# Altium schematic sheet Red_Driver.SchDoc
size 381 x 241 mm; SheetNumber: 6; SheetTotal: 7
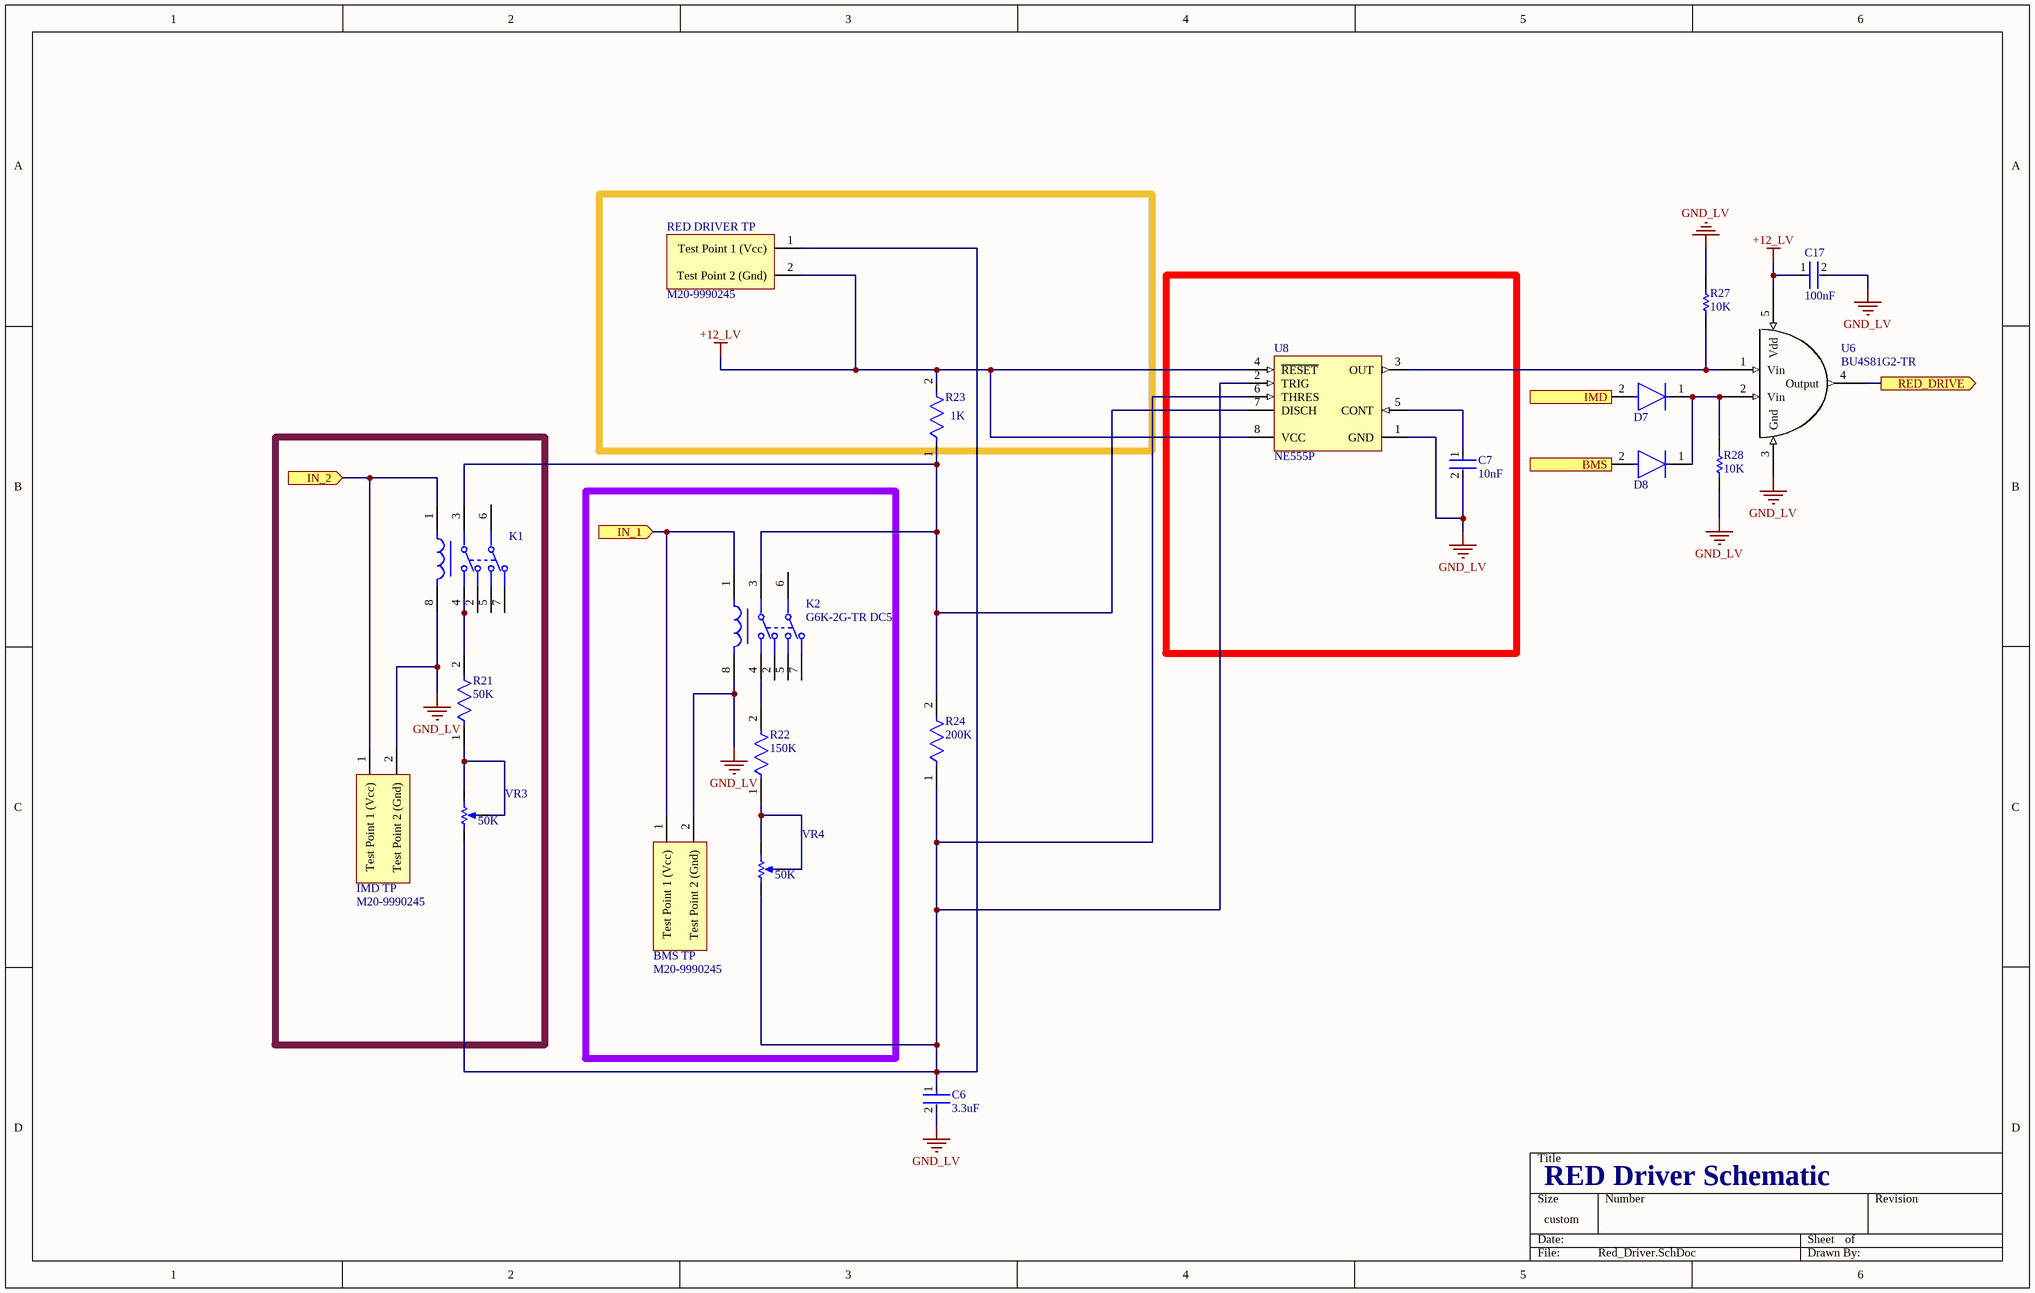
[diagram p0: Red_Driver.SchDoc]

## Parts
BMS_TP  M20-9990245  [12MM_HEADER__M20-9991245]
C6  3.3uF  [FP-RCE2K1-MFG]
C7  10nF  [FP-K155L2-MFG]
C17  100nF  [FP-C1206C-EB-MFG]
D7  DO-204AH_8_CENTRALSEMI_1  [FP-JANTXV1N486B-MFG]  (value not drawn)
D8  DO-204AH_8_CENTRALSEMI_1  [FP-JANTXV1N486B-MFG]  (value not drawn)
IMD_TP  M20-9990245  [12MM_HEADER__M20-9991245]
K1  G6K-2G-TR DC5  [FP-G6K-2G-TR_DC5-MFG]  (value not drawn)
K2  G6K-2G-TR DC5  [FP-G6K-2G-TR_DC5-MFG]
R21  50K  [RS00550K00FE73-Footprint-1]
R22  150K  [MFR-25FTE52-150K-Footprint-1]
R23  1K  [FP-RLR07-MFG]
R24  200K  [CFR-25JB-52-200K-Footprint-1]
R27  10K  [R_1206_YAGEO_AC]
R28  10K  [R_1206_YAGEO_AC]
RED_DRIVER_TP  M20-9990245  [12MM_HEADER__M20-9991245]
U6  BU4S81G2-TR  [SSOP5__ROHM_SEMICONDUCTOR__TSZ02201-0RDR0GZ00200-1-2]
U8  NE555P  [P0008A]
VR3  50K  [3006P-1-503LF-Footprint-1]
VR4  50K  [3006P-1-503LF-Footprint-1]

## Ports
BMS (in), IMD (in), IN_1 (in), IN_2 (in), RED_DRIVE (out)

## Nets
+12_LV: C17.1 R23.2 RED_DRIVER_TP.2(Test_Point_2_(Gnd)) U6.5(Vdd) U8.4(~{RESET}) U8.8(VCC)
GND_LV: BMS_TP.2(Test_Point_2_(Gnd)) C6.2 C7.2 C17.2 IMD_TP.2(Test_Point_2_(Gnd)) K1.8 K2.8 R27.1 R28.2 U6.3(Gnd) U8.1(GND)
BMS: D8.2(A) ; port BMS
IMD: D7.2(A) ; port IMD
IN_1: BMS_TP.1(Test_Point_1_(Vcc)) K2.1 ; port IN_1
IN_2: IMD_TP.1(Test_Point_1_(Vcc)) K1.1 ; port IN_2
RED_DRIVE: U6.4(Output) ; port RED_DRIVE
NetC6_1: C6.1 R24.1 RED_DRIVER_TP.1(Test_Point_1_(Vcc)) U8.2(TRIG) U8.6(THRES) VR3.3(CW) VR4.3(CW)
NetC7_1: C7.1 U8.5(CONT)
NetD7_1: D7.1(C) D8.1(C) R28.1 U6.2(Vin)
NetK1_3: K1.3 K2.3 R23.1 R24.2 U8.7(DISCH)
NetK1_4: K1.4 R21.2
NetK2_4: K2.4 R22.2
NetR21_1: R21.1 VR3.1(CCW) VR3.2(WIPER)
NetR22_1: R22.1 VR4.1(CCW) VR4.2(WIPER)
NetR27_2: R27.2 U6.1(Vin) U8.3(OUT)

Not connected (* = marked no-connect by the designer): K1 2 5 6 7; K2 2 5 6 7

## Notes on the sheet
- RED Driver Schematic

## Library data of the parts
BMS_TP IMD_TP RED_DRIVER_TP = CMP-081-000004-1: CONN HEADER VERT 2POS 2.54MM; Manufacturer: Harwin Inc.; PN: 952-2261-ND; Max Operating Temperature: 105 °C; Min Operating Temperature: -40 °C; ComponentLink1URL: https://www.digikey.ca/en/products/detail/harwin-inc/M20-9990245/3728225; ComponentLink1Description: Datasheet
C6 = CMP-00004-1: Ceramic Capacitor, Ceramic, 25V, 10% +Tol, 10% -Tol, X7R, -/+15ppm/Cel TC, 3.3uF, 2212; Reference Standard: AEC-Q200; Value: 3.3uF; Min Operating Temperature: -55°C; Tolerance (fill in as +-): 10%; Max Operating Temperature: 125°C; RoHS Compliant: Yes; Terminal Pitch: 5mm; Packaging: Ammo Pack; ComponentLink1Description: Datasheet; Rated DC Voltage (URdc): 25V; Width: 3.15mm; Temperature Characteristics Code: X7R; Package Style: RadialMeter; Height: 4mm; Capacitor Type: Ceramic; Reach SVHC Compliant: Yes; Case/Package: 2212; Length: 5.5mm; Dielectric Material: Ceramic; Pins: 2; Tolerance  (fill in as +-): 10%
C7 = CMP-00007-1: Ceramic Capacitor, Multilayer, Ceramic, 50V, 10% +Tol, 10% -Tol, X7R, 15% TC, 0.01uF, Through Hole Mount; Multilayer: Yes; Capacitor Type: Ceramic; Dielectric Material: Ceramic; Min Operating Temperature: -55°C; Terminal Finish: Tin; Package Shape: Rectangular; Packaging: Tape and Reel; Length: 4mm; Terminal Pitch: 2.5mm; Tolerance (fill in as +-): 10%; Value: 10nF; Tolerance  (fill in as +-): 10%; Mounting Technology: Through Hole; RoHS Compliant: Yes; JESD-609 Code: e3; Termination: Wire; ComponentLink1Description: Datasheet; Rated DC Voltage (URdc): 50V; Max Operating Temperature: 125°C; Package Style: RadialMeter; Pins: 2; Temperature Characteristics Code: X7R; Width: 2.5mm; Height: 5.58mm; Reach SVHC Compliant: Yes
C17 = CMP-03020-000153-1: CAP CER 0.1UF 100V X7R 1206; Manufacturer: KEMET; Manufacturer Part Number: C1206C104K1RACTU; Value: 0.10 μF; Tolerance: 0.1; Material: Ceramic; Temperature Coefficient: 15%; Automotive Grade: Grade 0; Voltage Rating: 100 V; Automotive: Yes; Ipc Land Pattern Name: CAPC320160X78; Device Class L1: Passive Components; ComponentLink2Description: Datasheet; Temperature Range Low: -55°C; Category: Cap; Octopart: https://octopart.com/c1206c104k1ractu-kemet-89521; Height: 0.88mm; Lead Free: Yes; Digikey Description: CAP CER 0.1UF 100V X7R 1206; Mouser Description: CAP CER 0.1UF 100V X7R 1206; Device Class L3: Ceramic Capacitors; Device Class L2: Capacitors; ComponentLink2URL: https://content.kemet.com/datasheets/KEM_C1007_X8R_ULTRA_150C_SMD.pdf; Temperature Range High: +150°C; Temperature Characteristic: X7R; RoHS: TRUE; Capacitance: 0.10 μF; Package: C1206C-EB; Temperature: -55°C to +150°C
D7 D8 = CMP-00002-1: Diode 250 V 200mA Through Hole DO-35; Max Inverse Voltage: 250 V; Forward Voltage: 1 V; Max Inverse Current: 50 nA; Forward Current: 100 mA; Max Operating Temperature: 200°C; Case/Package: DO-204AH; ComponentLink1Description: Datasheet
K1 K2 = CMP-08823-000110-1: RELAY TELECOM DPDT 1A 5VDC; RoHS Compliant: Yes
R21 = CMP-069-000013-1: Fixed Resistor, Wire Wound, 5W, 50000ohm, 1% +/-Tol, 20ppm/Cel, Through Hole Mount; Min Operating Temperature: -65°C; ComponentLink1Description: Datasheet; Max Operating Temperature: 250°C; Tolerance: 1%
R22 = CMP-069-000014-1: Fixed Resistor, Metal Film, 0.25W, 150000ohm, 250V, 1% +/-Tol, -50,50ppm/Cel; ComponentLink1Description: Datasheet
R23 = CMP-00030-39447724-1: RLR07C1001FSB14 Fixed Resistor, Metal Film, 0.25W, 1000ohm, 250V, 1% +/-Tol, 100ppm/Cel, Through Hole Mount; Wire/Cable Diameter: 50.8µm; Lead Diameter: 640µm; Max Power Dissipation: 250mW; Temperature Coefficient: 100ppm/°C; Resistance: 100Ω; Lead Length: 38.1mm; Voltage Rating: 250V; Lead Free: Contains Lead; REACH SVHC: Unknown; Packaging: Bulk; Military Standard: MIL-PRF-39017; Width: 2.29mm; Max Operating Temperature: 150°C; Length: 7.62mm; Min Operating Temperature: -65°C; Composition: Metal Film; Diameter: 2.29mm; Radiation Hardening: No; Features: Military, Moisture Resistant, Weldable; Failure Rate: 0.001%; Case/Package: Conformal; Tolerance: 1%; Voltage Rating (DC): 250V; Schedule B: 8533210090, 8533210090; RoHS: Non-Compliant; Termination: Axial; Power Rating: 250mW; Contact Plating: Lead, Tin; NexarPartId: 39447724; Number of Terminations: 2; Number of Pins: 14
R24 = CMP-069-000015-1: Fixed Resistor, Carbon Film, 0.25W, 200000ohm, 250V, 5% +/-Tol, -700,0ppm/Cel, Through Hole Mount; Min Operating Temperature: -55°C; Tolerance: 5%; ComponentLink1Description: Datasheet; Max Operating Temperature: 155°C
R27 R28 = CMP-078-000543-1: RES SMD 10K OHM 1% 1/4W 1206; Manufacturer: YAGEO; Max Power: 0.25W, 1/4W; PN: AC1206FR-0710KL; Package: 1206 (3216 Metric); Tolerance: 1%; ComponentLink1Description: Datasheet; Max Operating Temperature: 155°C; Min Operating Temperature: -55°C; ComponentLink1URL: https://www.yageo.com/upload/media/product/productsearch/datasheet/rchip/PYu-AC_51_RoHS_L_9.pdf; Resistance Raw: 10k; Resistance: 10k
U6 = CMP-003-000056-1: IC GATE AND 1CH 2-INP 5SSOP; Min-Max Input: 0V - V(supp); Temputare Range: -40°C to +85°C; Min-Max Supply Voltage: 3V to 16V; PN: BU4S81G2-TR; Datasheet: https://fscdn.rohm.com/en/products/databook/datasheet/ic/logic_switch/standard_logic/bu4s81g2-e.pdf
U8 = CMP-2000-04954-1: Precision Timer, 4.5 to 16 V, 0 to 70 degC, 8-Pin DIP, Pb-Free, Tube; Manufacturer: TexasInstruments; Maximum High Level Output Current: -200mA; Number of Internal Timers: 1; Operating Supply Voltage: 5; Maximum Low Level Output Current: 200mA; Rad Hard: No; Packaging: Rail/Tube; Manufacturer URL: http://www.ti.com/; Package Reference: P8; Package Description: 8-Pin Double In-line Package, Body 9.59 x 6.35 mm, Pitch 2.54 mm; Package URL: http://www.ti.com/lit/ml/mpdi001b/mpdi001b.pdf; Type: Standard; Datasheet URL: http://www.ti.com/general/docs/lit/getliterature.tsp?genericPartNumber=NE555&fileType=pdf; Category: Timer; Package: 8PDIP; Datasheet Version: Rev. I, 09/2014
VR3 VR4 = CMP-069-000016-1: Trimmer, Cermet, 0.75W, 50000ohm, 400V, 10% +/-Tol, -100,100ppm/Cel, 15 Turn(s), 7519; Tolerance: 10%; ComponentLink1Description: Datasheet; Max Operating Temperature: 125°C; Min Operating Temperature: -55°C